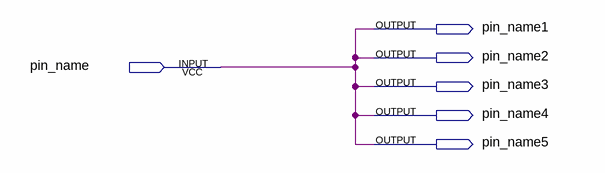
[diagram p0: schematic sheet]
// Quartus schematic Expansor.bdf as structural Verilog: 0 symbols, 6 pins
module Expansor (
  input  pin_name,
  output pin_name1,
  output pin_name2,
  output pin_name3,
  output pin_name4,
  output pin_name5
);


  assign pin_name1 = pin_name;
  assign pin_name2 = pin_name;
  assign pin_name3 = pin_name;
  assign pin_name4 = pin_name;
  assign pin_name5 = pin_name;
endmodule
